# Altium schematic sheet 12V Input Circuitry.SchDoc
size A4
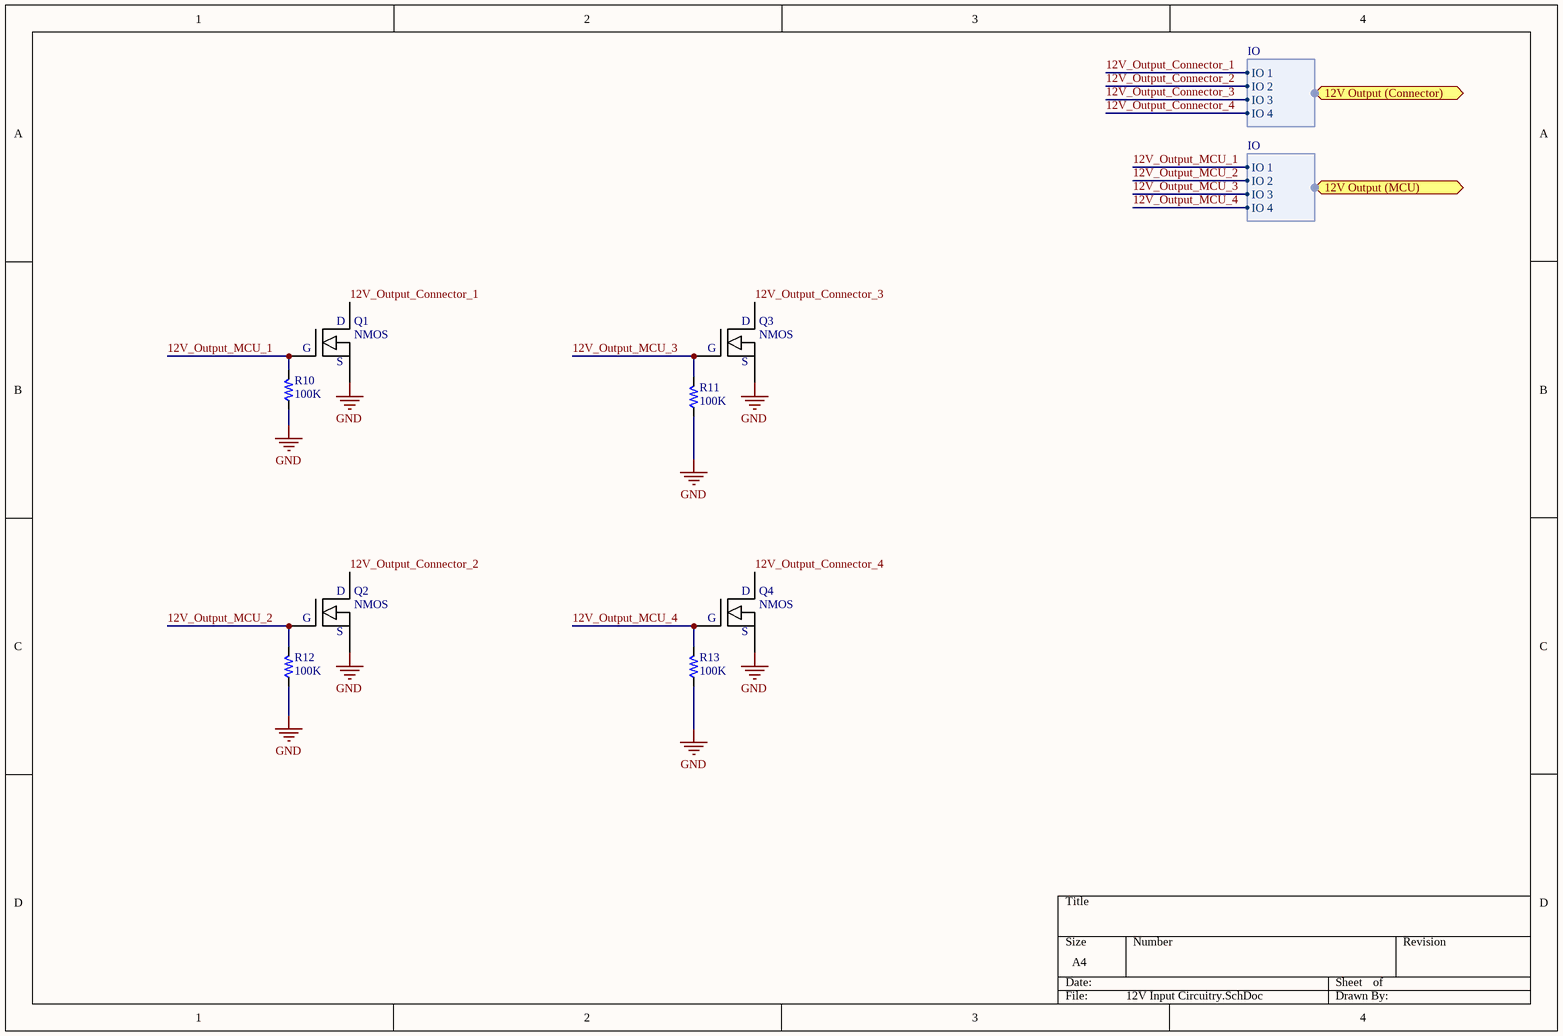
[diagram p0: 12V Input Circuitry.SchDoc]

## Parts
Q1  NMOS  [NMOS - SSM3K333R - SOTFL95P180X88-3M]
Q2  NMOS  [NMOS - SSM3K333R - SOTFL95P180X88-3M]
Q3  NMOS  [NMOS - SSM3K333R - SOTFL95P180X88-3M]
Q4  NMOS  [NMOS - SSM3K333R - SOTFL95P180X88-3M]
R10  value 100K  [PCB_GENERIC_SMD_0603]  (hidden comment: R060-00104-05)
R11  value 100K  [PCB_GENERIC_SMD_0603]  (hidden comment: R060-00104-05)
R12  value 100K  [PCB_GENERIC_SMD_0603]  (hidden comment: R060-00104-05)
R13  value 100K  [PCB_GENERIC_SMD_0603]  (hidden comment: R060-00104-05)

## Ports
12V Output (Connector) (harness IO), 12V Output (MCU) (harness IO)

## Harnesses
IO: IO 1, IO 2, IO 3, IO 4

## Nets
GND: Q1.2(S) Q2.2(S) Q3.2(S) Q4.2(S) R10.1 R11.1 R12.1 R13.1
12V_Output_Connector_1: Q1.3(D) ; port 12V Output (Connector).IO 1
12V_Output_Connector_2: Q2.3(D) ; port 12V Output (Connector).IO 2
12V_Output_Connector_3: Q3.3(D) ; port 12V Output (Connector).IO 3
12V_Output_Connector_4: Q4.3(D) ; port 12V Output (Connector).IO 4
12V_Output_MCU_1: Q1.1(G) R10.2 ; port 12V Output (MCU).IO 1
12V_Output_MCU_2: Q2.1(G) R12.2 ; port 12V Output (MCU).IO 2
12V_Output_MCU_3: Q3.1(G) R11.2 ; port 12V Output (MCU).IO 3
12V_Output_MCU_4: Q4.1(G) R13.2 ; port 12V Output (MCU).IO 4

## Library data of the parts
Q1-Q4 = NMOS - SSM3K333R
R10-R13 = R060-00104-05: RES 0603 100K 5% 63mW; Tolerance: 5%; Power: 63mW; Package: 0603